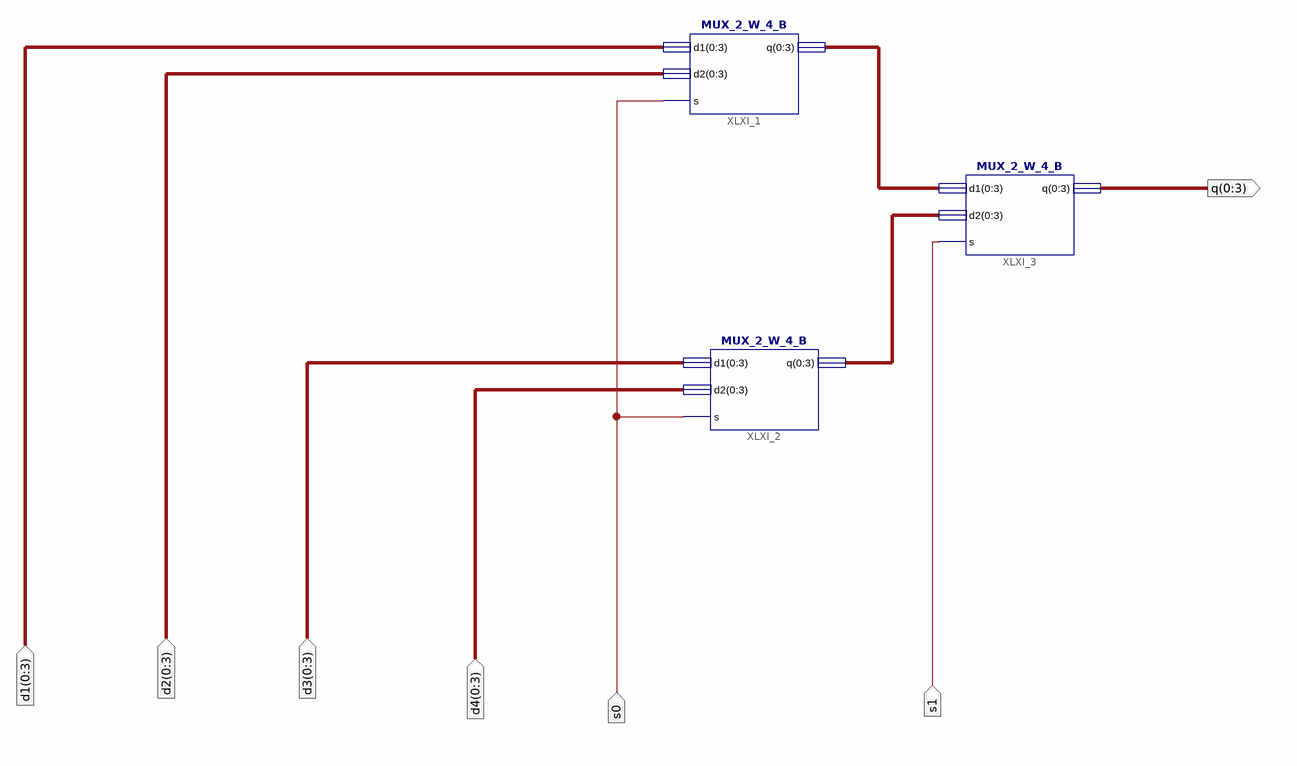
[diagram p0: schematic sheet 1]
// Xilinx ISE schematic MUX_4_WAY_4_BIT.sch (spartan3e) as structural Verilog: 3 symbols, 7 ports
module MUX_4_WAY_4_BIT (
  input  [0:3] d1,
  input  [0:3] d2,
  input  [0:3] d3,
  input  [0:3] d4,
  input  s0,
  input  s1,
  output [0:3] q
);

  wire [3:0] XLXN_9, XLXN_10;

  MUX_2_W_4_B XLXI_1 (.d1(d1), .d2(d2), .q({XLXN_9[0], XLXN_9[1], XLXN_9[2], XLXN_9[3]}), .s(s0));
  MUX_2_W_4_B XLXI_2 (.d1(d3), .d2(d4), .q({XLXN_10[0], XLXN_10[1], XLXN_10[2], XLXN_10[3]}), .s(s0));
  MUX_2_W_4_B XLXI_3 (
    .d1({XLXN_9[0], XLXN_9[1], XLXN_9[2], XLXN_9[3]}), .d2({XLXN_10[0], XLXN_10[1], XLXN_10[2], XLXN_10[3]}),
    .q(q), .s(s1));
endmodule
